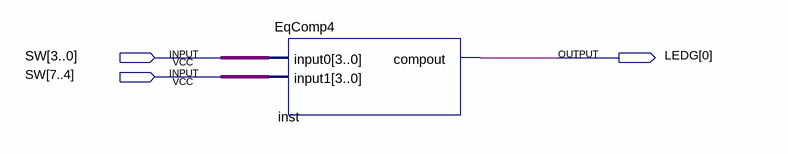
[diagram p0: schematic sheet]
// Quartus schematic EqCompDemo.bdf as structural Verilog: 1 symbols, 3 pins
module EqCompDemo (
  input  [7:0] SW,
  output [0:0] LEDG
);

  EqComp4 inst (.input0(SW[3:0]), .input1(SW[7:4]), .compout(LEDG[0]));
endmodule
